# Altium schematic sheet ETH_HMI.SchDoc
size A3
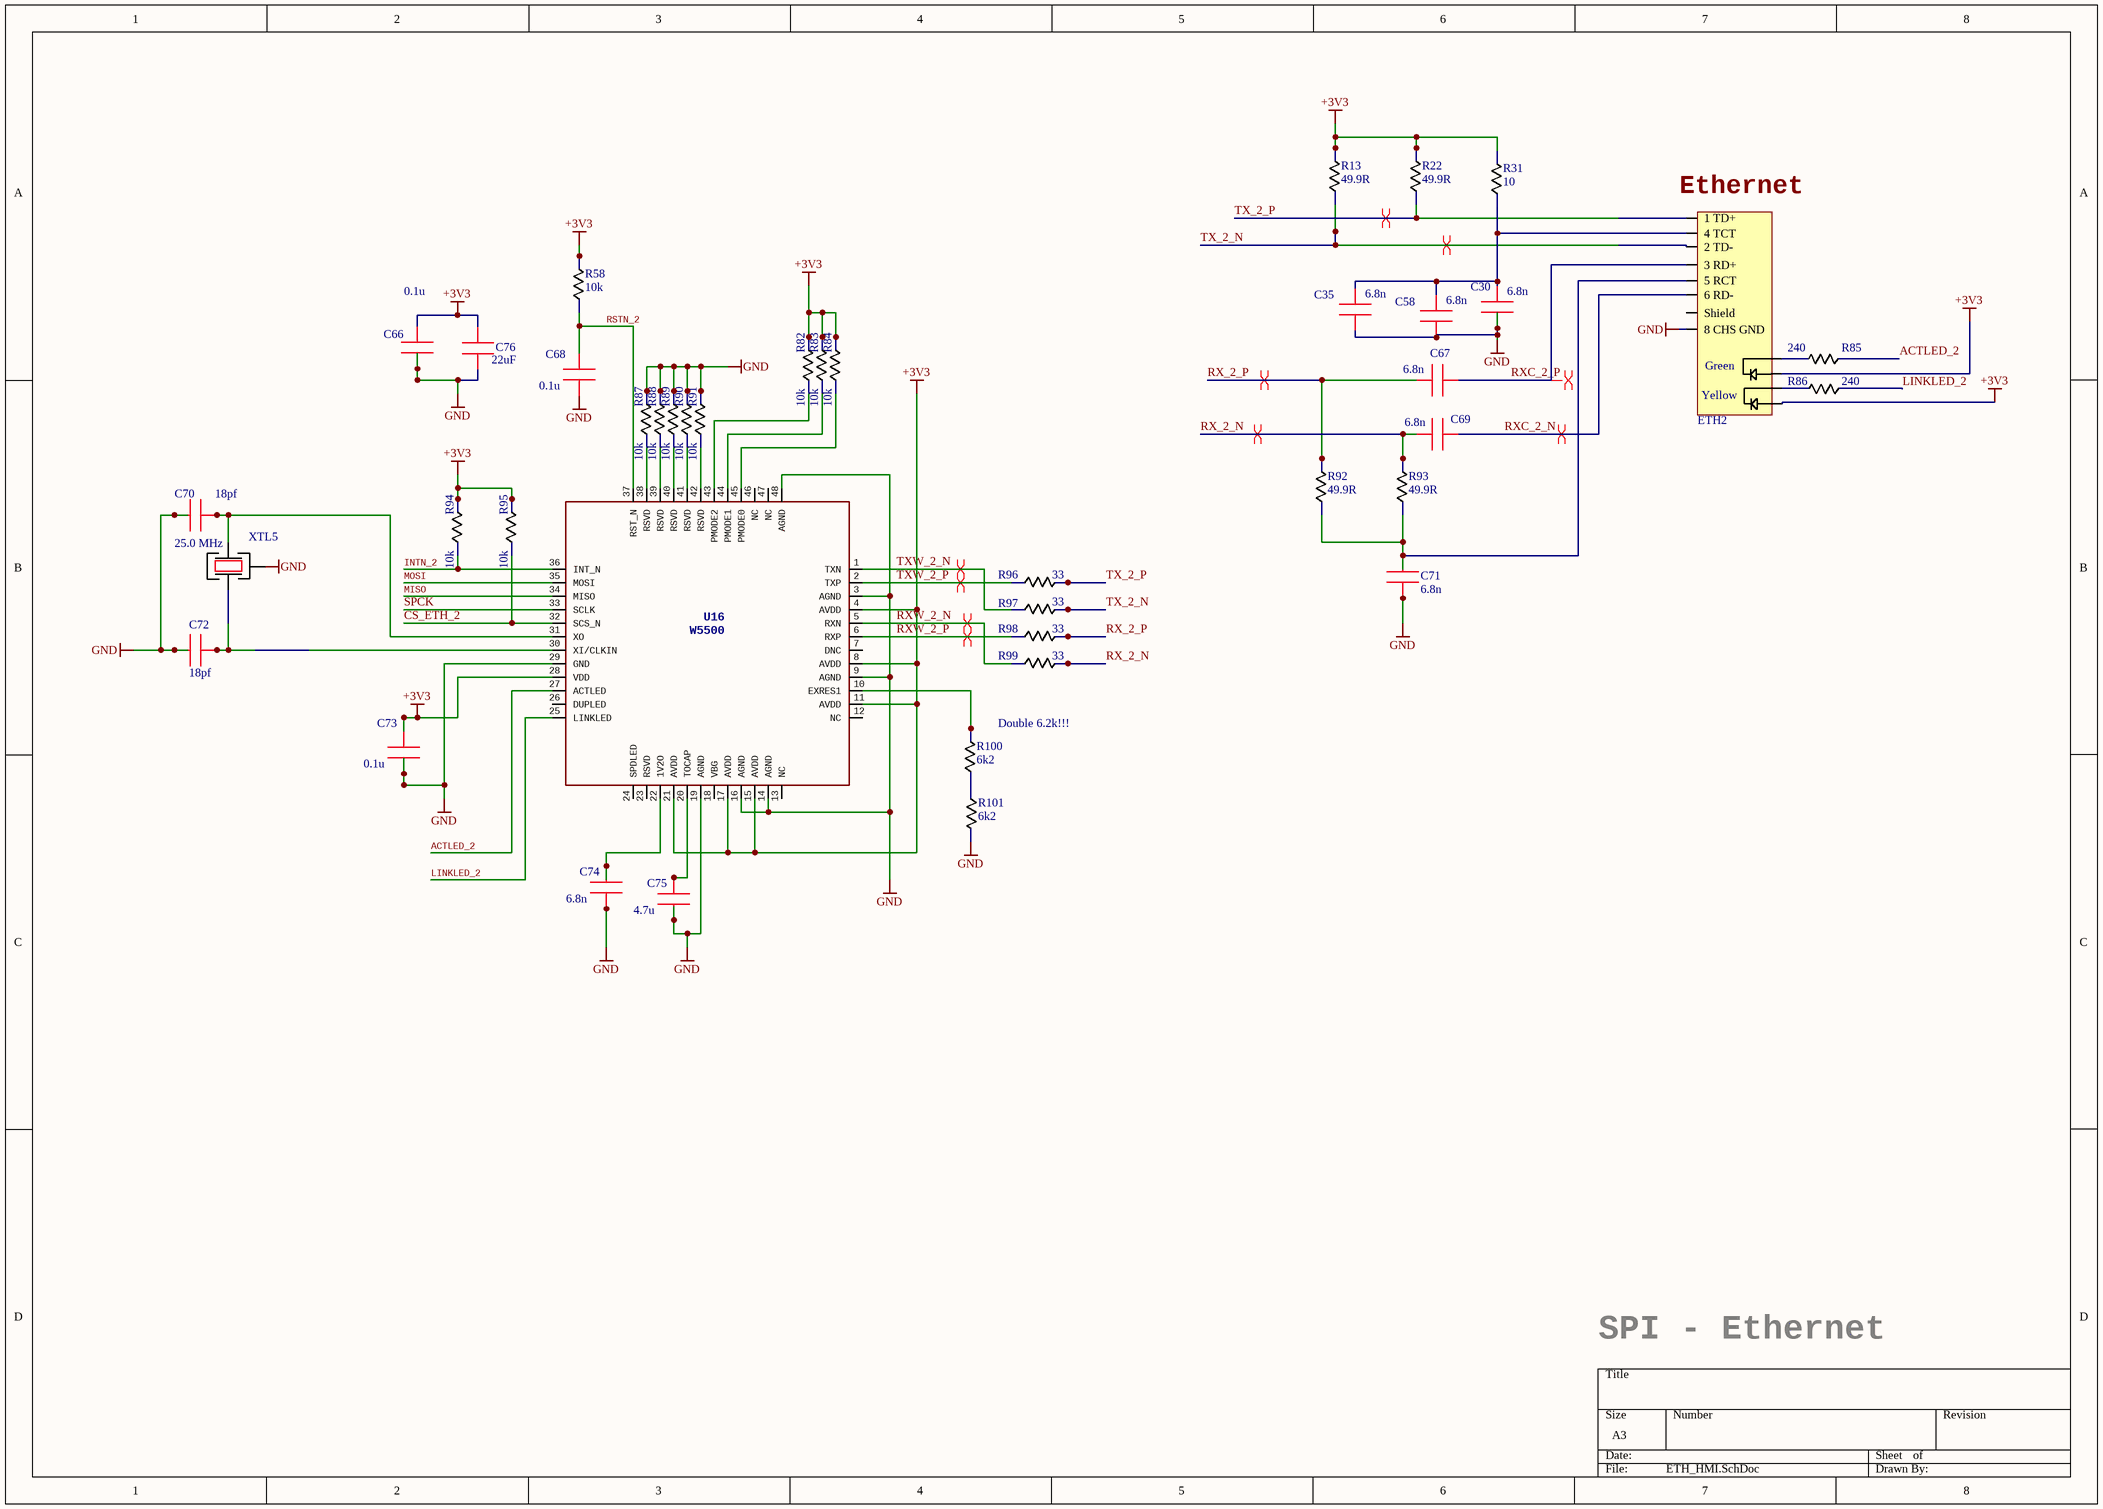
[diagram p0: ETH_HMI.SchDoc]

## Parts
C30  6.8n  [0603 CAP]
C35  6.8n  [0603 CAP]
C58  6.8n  [0603 CAP]
C66  0.1u  [0603 CAP]
C67  6.8n  [0603 CAP]
C68  0.1u  [0603 CAP]
C69  6.8n  [0603 CAP]
C70  18pf  [0603 CAP]
C71  6.8n  [0603 CAP]
C72  18pf  [0603 CAP]
C73  0.1u  [0603 CAP]
C74  6.8n  [0603 CAP]
C75  4.7u  [0603 CAP]
C76  22uF  [CAP CER 1210 NP]
ETH2  ETH?  [J011D21BNL]  (value not drawn)
R13  49.9R  [0603 - RES]
R22  49.9R  [0603 - RES]
R31  10  [0603 - RES]
R58  10k  [0603 - RES]
R82  10k  [0603 - RES]
R83  10k  [0603 - RES]
R84  10k  [0603 - RES]
R85  240  [0603 - RES]
R86  240  [0603 - RES]
R87  10k  [0603 - RES]
R88  10k  [0603 - RES]
R89  10k  [0603 - RES]
R90  10k  [0603 - RES]
R91  10k  [0603 - RES]
R92  49.9R  [0603 - RES]
R93  49.9R  [0603 - RES]
R94  10k  [0603 - RES]
R95  10k  [0603 - RES]
R96  33  [0603 - RES]
R97  33  [0603 - RES]
R98  33  [0603 - RES]
R99  33  [0603 - RES]
R100  6k2  [0603 - RES]
R101  6k2  [0603 - RES]
U16  W5500  [LQFP 48]
XTL5  25.0 MHz  [XTAL KX-7T]

## Nets
+3V3: C66.1 C73.1 C76.2 ETH2.9(LDGr) ETH2.12(LDYE) R13.2 R22.2 R31.2 R58.2 R82.2 R83.2 R84.2 R94.2 R95.2 U16.4(AVDD) U16.8(AVDD) U16.11(AVDD) U16.15(AVDD) U16.17(AVDD) U16.21(AVDD) U16.28(VDD)
GND: C30.2 C35.2 C58.2 C66.2 C68.2 C70.1 C71.2 C72.1 C73.2 C74.2 C75.2 C76.1 ETH2.8(8_CHS_GND) R87.2 R88.2 R89.2 R90.2 R91.2 R101.2 U16.3(AGND) U16.9(AGND) U16.14(AGND) U16.16(AGND) U16.19(AGND) U16.29(GND) U16.48(AGND) XTL5.2
ACTLED_2: R85.1 U16.27(ACTLED)
CS_ETH_2: R95.1 U16.32(SCS_N)
INTN_2: R94.1 U16.36(INT_N)
LINKLED_2: R86.1 U16.25(LINKLED)
MISO: U16.34(MISO)
MOSI: U16.35(MOSI)
RSTN_2: C68.1 R58.1 U16.37(RST_N)
RX_2_N: C69.1 R93.2 R99.2
RX_2_P: C67.1 R92.2 R98.2
RXC_2_N: C69.2 ETH2.6(6_RD-)
RXC_2_P: C67.2 ETH2.3(3_RD+)
RXW_2_N: R99.1 U16.5(RXN)
RXW_2_P: R98.1 U16.6(RXP)
SPCK: U16.33(SCLK)
TX_2_N: ETH2.2(2_TD-) R13.1 R97.2
TX_2_P: ETH2.1(1_TD+) R22.1 R96.2
TXW_2_N: R97.1 U16.1(TXN)
TXW_2_P: R96.1 U16.2(TXP)
NetC30_1: C30.1 C35.1 C58.1 ETH2.4(4_TCT) R31.1
NetC70_2: C70.2 U16.31(XO) XTL5.3
NetC71_1: C71.1 ETH2.5(5_RCT) R92.1 R93.1
NetC72_2: C72.2 U16.30(XI/CLKIN) XTL5.1
NetC74_1: C74.1 U16.22(1V2O)
NetC75_1: C75.1 U16.20(TOCAP)
NetETH2_10: ETH2.10(LDGr) R85.2
NetETH2_11: ETH2.11(LDYE) R86.2
NetR82_1: R82.1 U16.43(PMODE2)
NetR83_1: R83.1 U16.44(PMODE1)
NetR84_1: R84.1 U16.45(PMODE0)
NetR87_1: R87.1 U16.38(RSVD)
NetR88_1: R88.1 U16.39(RSVD)
NetR89_1: R89.1 U16.40(RSVD)
NetR90_1: R90.1 U16.41(RSVD)
NetR91_1: R91.1 U16.42(RSVD)
NetR100_1: R100.1 R101.1
NetR100_2: R100.2 U16.10(EXRES1)

Not connected (* = marked no-connect by the designer): ETH2 SHIELD(Shield); U16 7(DNC) 12(NC) 13(NC) 18(VBG) 23(RSVD) 24(SPDLED) 26(DUPLED) 46(NC) 47(NC)

## Layout directives
differential pair: RX_2_N, RX_2_P, RXC_2_N, RXC_2_P, RXW_2_N, RXW_2_P, TX_2_N, TX_2_P, TXW_2_N, TXW_2_P

## Notes on the sheet
- (near ETH2) Ethernet
- (near R100) Double 6.2k!!!
- SPI - Ethernet
- (in symbol J0011D21BNL) Green; Yellow

## Library data of the parts
C30 C35 C58 = 0603 CAP: GRM188R71H223KA01D
C66 C68 C73 = 0603 CAP: GRM188R71E104KA01D
C67 C69 = 0603 CAP: CC0603KRX7R9BB682
C70 C72 = 0603 CAP: GRM1885C1H180JA01D
C71 C74 = 0603 CAP
C75 = 0603 CAP: GRM188R61A475KE15D
C76 = 0805 Cap: CC1210KKX5R7BB226
ETH2 = J0011D21BNL
R13 R22 R92 R93 = 0603 RES: RC0603FR-0749R9
R31 R85 R86 = 0603 RES: CRCW060310R0FKEA
R58 R82-R84 R87-R91 R94 R95 = 0603 RES: RC0603JR-0710K
R96-R99 = 0603 RES: RC0603FR-0733R
R100 = 0603 RES: RC0603FR-076K2
R101 = Resistor 0805: 0805 SMD Resistor
XTL5 = KX-7: Geyer KX-7 25.0 MHz